# EasyEDA Pro project 整体参考PCB.epro

# Schematic Schematic1
Assembly Variant: Basic; Board Name: Board1; Create Date: 2026-06-18; Page Name: P1; Project Name: TI_MSPM0_2.0; Schematic Name: Schematic1; Update Date: 2026-06-18; Company: 嘉立创EDA; Page Size: A4; Version: V1.0
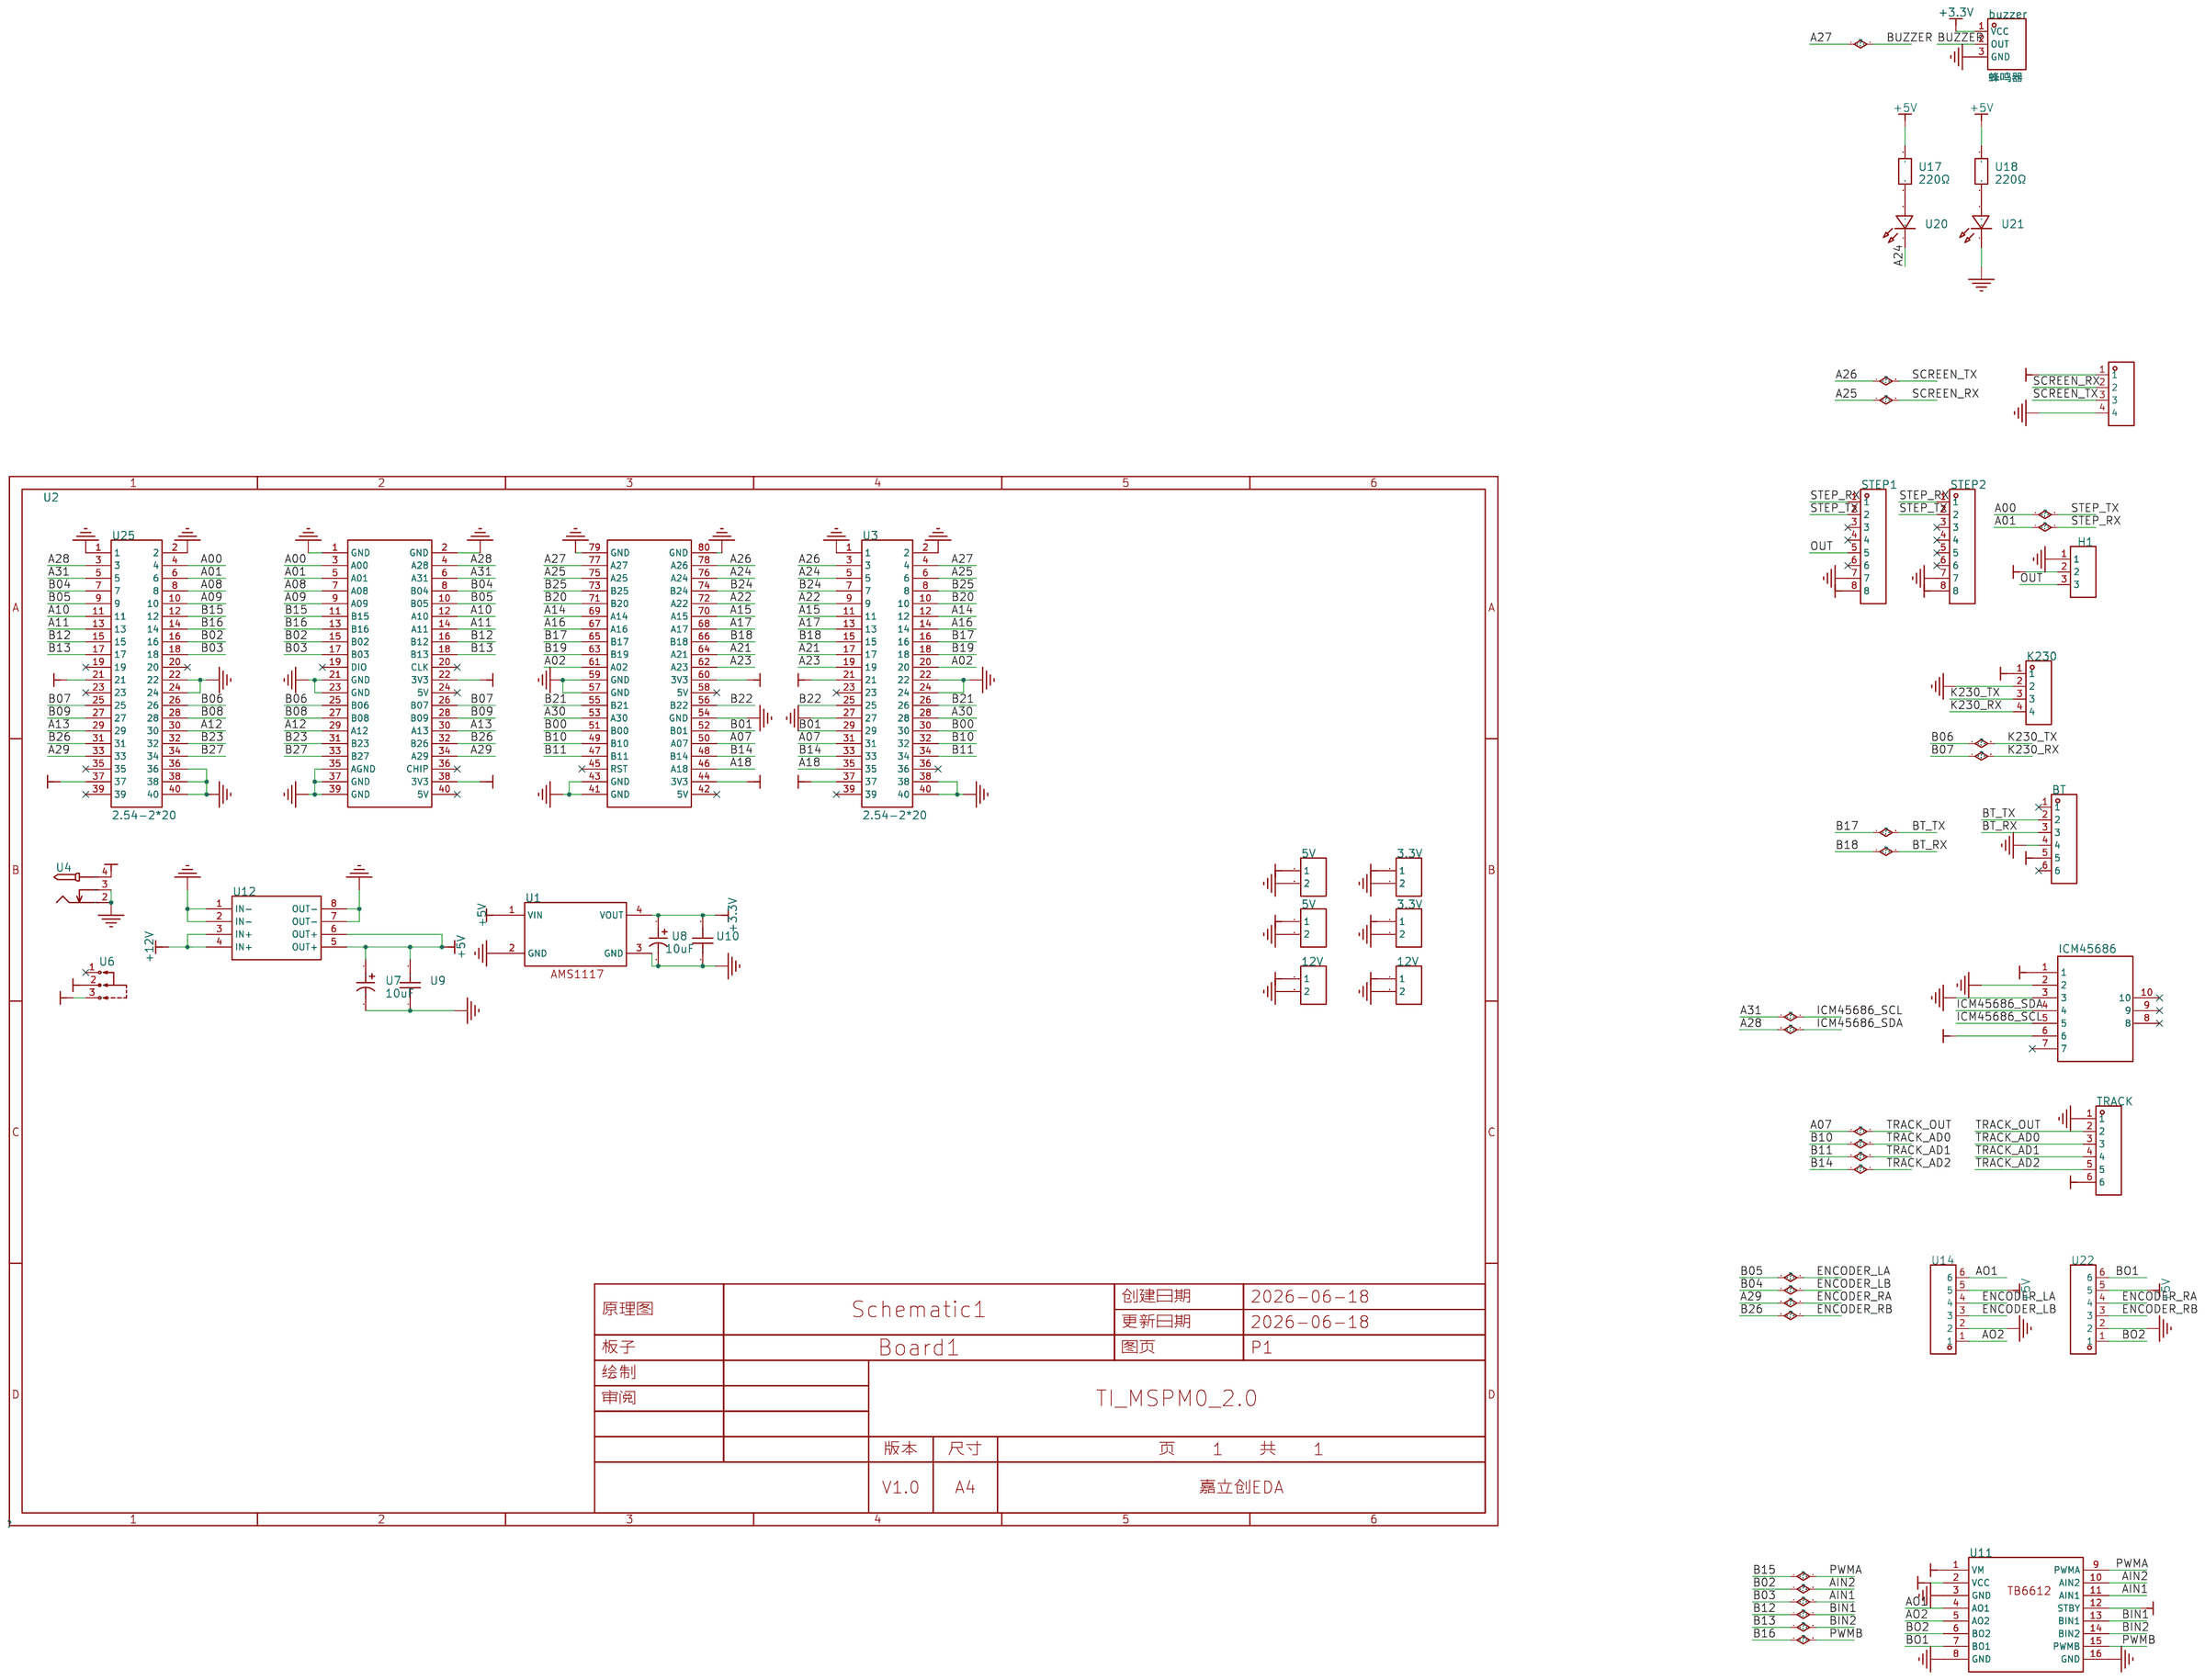
[diagram p0: schematic sheet]

## Parts
3.3V  -  [HDR-TH_2P-P2.54-V-F]
3.3V#2  -  [HDR-TH_2P-P2.54-V-F]
5V  -  [HDR-TH_2P-P2.54-V-F]
5V#2  -  [HDR-TH_2P-P2.54-V-F]
12V  -  [HDR-TH_2P-P2.54-V-F]
12V#2  -  [HDR-TH_2P-P2.54-V-F]
BT  -  [HDR-TH_6P-P2.54-V-F]
buzzer  蜂鸣器  [蜂鸣器]
H1  -  [HDR-TH_3P-P2.54-V-F]
ICM45686  -  [ICM45686]
K230  -  [HDR-TH_4P-P2.54-V-F]
STEP1  ZX-XH2.54-8PZZ  [CONN-TH_8P-P2.50-XH2.54-8P]
STEP2  ZX-XH2.54-8PZZ  [CONN-TH_8P-P2.50-XH2.54-8P]
TRACK  -  [HDR-TH_6P-P2.54-V-F]
U1  -  [AMS1117模块]
U2  LCKFB-TMX-MSPM0G3507  [COMM-TH_LCKFB-TMX-MSPM0G3507]
U3  2.54-2*20  [HDR-TH_40P-P2.54-V-F-R2-C20-S2.54]
U4  DC005-2.5  [DC-IN-TH_DC005-2.5MM]
U6  SS12D10G5  [SW-TH_SHOU-HAN_SS12D10G4]
U7  10uF  [CAP-TH_BD5.0-P2.00-D0.5-FD-1]
U8  10uF  [CAP-TH_BD5.0-P2.00-D0.5-FD-1]
U9  -  [0.1uf陶瓷电容直插]
U10  -  [0.1uf陶瓷电容直插]
U11  -  [TB6612]
U12  -  [MP1584EN降压模块]
U14  ZX-XH2.54-6PWZ  [CONN-TH_6P-P2.50_ZX-XH2.54-6PWZ]
U16  ZX-XH2.54-4PZZ  [CONN-TH_4P-P2.50_4PIN]
U17  220Ω  [RES-TH_BD2.7-L6.2-P10.20-D0.4]
U18  220Ω  [RES-TH_BD2.7-L6.2-P10.20-D0.4]
U20  LTL-307E  [LED-TH_BD3.0-P2.54-FD]
U21  LTL-307E  [LED-TH_BD3.0-P2.54-FD]
U22  ZX-XH2.54-6PWZ  [CONN-TH_6P-P2.50_ZX-XH2.54-6PWZ]
U25  2.54-2*20  [HDR-TH_40P-P2.54-V-F-R2-C20-S2.54]

## Library data of the parts
3.3V 3.3V#2 5V 5V#2 12V 12V#2 = HDR-F_2.54_1x2P: Supplier Part: C49661; Supplier Footprint: 插件
BT TRACK = HDR-F_2.54_1x6P: Supplier Part: C40877; Supplier Footprint: 插件
buzzer = 蜂鸣器: Supplier Part: C9900010938; Datasheet: https://atta.szlcsc.comnull; Supplier: LCSC
H1 = HDR-F_2.54_1x3P: Supplier Part: C541850; Supplier Footprint: 插件
ICM45686 = ICM45686
K230 = HDR-F_2.54_1x4P: Supplier Part: C2718488; Supplier Footprint: 插件
STEP1 STEP2 = ZX-XH2.54-8PZZ: 插针结构:1x8P;间距:2.5mm;安装方式:直插;参考系列:XH;总PIN数:8P;排数:1;每排PIN数:8;行距:-;额定电流:3A;触头材质:黄铜;触头镀层:锡;工作温度:-25℃~+85℃;; LCSC Part Name: 1x8P 间距:2.5mm 直插 系列:XH; Supplier Part: C7429638; Manufacturer: Megastar(兆星); Supplier Footprint: 插件,P=2.5mm; JLCPCB Part Class: Extended Part; Datasheet: https://item.szlcsc.com/datasheet/ZX-XH2.54-8PZZ/8427555.html; Supplier: LCSC; Pins Structure: 1x8P; Pitch: 2.5mm; Mounting Type: 直插; Reference Series: XH; Number of Pins: 8P; Number of Rows: 1; Number of PINs Per Row: 8; Current Rating: 3A; Contact Material: 黄铜; Contact Plating: 锡; Operating Temperature: -25℃~+85℃; Voltage Rating: 250V; Plastic Material: PA66; Flame Retardant Rating: UL94V-0; Color: 白色; Z-Height of the Board: 7mm; X-Length of Bottom Edge on Board (Spacing Line): 22.5mm; Y-Width of Bottom Edge on Board: 5.9mm
U1 = AMS1117模块: _: 3
U2 = LCKFB-TMX-MSPM0G3507: 该开发板板载德州仪器的微控制器核心,完美适配电赛指定TI芯片题目的要求。支持Keil、CCS和IAU等环境开发,搭配图形化代码生成工具,无需在意底层驱动,助力快速开发。硬件上带有多电源保护,防反接/防过流/受电压,和三路参考电压选择,降低电衰试错成本。80P引脚的引出方便扩展,提供完善的入门手册和模块移植案例。; LCSC Part Name: 5件套 立创·天猛星MSPM0G3507开发板; Supplier Part: C42378531; Manufacturer: 立创开发板; JLCPCB Part Class: Extended Part; Datasheet: https://item.szlcsc.com/datasheet/LCKFB-TMX-MSPM0G3507/44281600.html; Supplier: LCSC
U3 U25 = 2.54-2*20: 插孔结构:2x20P;间距:2.54mm;行距:2.54mm;圆孔/方孔:方孔;安装类型:直插;排数:双排;总孔位数:40P;额定电流:2.5A;额定电压:-;插孔方向:顶部;塑高:8.5mm;工作温度范围:-40℃~+105℃;; LCSC Part Name: 间距:2.54mm 2x20P 直插; Supplier Part: C2977589; Manufacturer: ZHOURI(洲日); Supplier Footprint: 插件,P=2.54mm; JLCPCB Part Class: 扩展库; Datasheet: https://atta.szlcsc.com/upload/public/pdf/source/20220328/834E302BE3C038BBC5C70F5E02589B1E.pdf; Supplier: LCSC; Holes Structure: 2x20P; Pitch: 2.54mm; Row Spacing: 2.54mm; Circular Hole / Square Hole: 方孔; Mounting Type: 直插; Number of Rows: 双排; Number of Holes: 40P; Current Rating (Max): 2.5A; Holes Direction: 顶部; Insulation Height: 8.5mm; Operating Temperature Range: -40℃~+105℃
U4 = DC005-2.5: 连接器类型:DC电源插座;安装方式:弯插;触点内径:2.5mm;触点外径:6.3mm;额定电流:500mA;额定电压:30V;工作温度范围:-25℃~+70℃;; LCSC Part Name: DC电源插座 内径:2.5mm 外径:6.3mm; Supplier Part: C7507454; Manufacturer: SHOU HAN(首韩); Supplier Footprint: 插件; JLCPCB Part Class: 扩展库; Datasheet: https://atta.szlcsc.com/upload/public/pdf/source/20231013/7634FFE9E6B635EE77C0C008CDC877DB.pdf; Supplier: LCSC; Connector Type: DC电源插座; Mounting Style: 弯插; Inside Contact Diameter: 2.5mm; Outside Contact Diameter: 6.3mm; Current Rating (Max): 500mA; Voltage Rating (Max): 30V; Operating Temperature Range: -25℃~+70℃
U6 = SS12D10G5: 电路结构:单刀双掷;安装方式:直插;额定电流(DC):2A;额定电压(DC):125V;机械寿命:3千次;; LCSC Part Name: 两档立式插件 3脚拨动开关 柄长5.0mm; Supplier Part: C7431054; Manufacturer: SHOU HAN(首韩); Supplier Footprint: 插件; JLCPCB Part Class: 扩展库; Datasheet: https://atta.szlcsc.com/upload/public/pdf/source/20231130/7A3DB6A149BF0A1DCFFE64FFC07FE434.pdf; Supplier: LCSC; Circuit: 单刀双掷; Switch Length: 12.7mm; Switch Width: 6.7mm; Mounting Style: 直插; Current Rating (DC): 2A; Voltage Rating (DC): 125V; Mechanical Life: 3千次; Operating Temperature: -25℃~+70℃
U7 U8 = CV4R7MG511BP: 容值:4.7uF;精度:±20%;额定电压:50V;纹波电流:58mA@100kHz;等效串联电阻(ESR):2.5Ω@100kHz;; LCSC Part Name: 4.7uF ±20% 50V; Supplier Part: C2844413; Manufacturer: TWBOR(伯鸿); Supplier Footprint: 插件,D5xL11mm; JLCPCB Part Class: 扩展库; Datasheet: https://atta.szlcsc.com/upload/public/pdf/source/20210727/C2844413_0C02A797581ED1BB0754F03B8FF69A80.pdf; Supplier: LCSC; Tolerance: ±20%; Voltage Rating: 50V; Ripple Current: 58mA@100kHz; Equivalent Series Resistance(ESR): 2.5Ω@100kHz; Pin Spacing: 2mm; Diameter: 5mm; Height - Seated (Max): 11mm; Lifetime: 5000hrs@105℃; Operating Temperature: -40℃~+105℃
U9 U10 = 0.1uf陶瓷电容直插
U11 = TB6612
U12 = MP1584EN降压模块: _: 3
U14 U22 = ZX-XH2.54-6PWZ: 插针结构:1x6P;间距:2.5mm;安装方式:弯插;参考系列:XH;总PIN数:6P;排数:1;每排PIN数:6;行距:-;额定电流:2A;触头材质:黄铜;触头镀层:锡;工作温度:-25℃~+85℃;; LCSC Part Name: 1x6P 间距:2.5mm 弯插 系列:XH; Supplier Part: C7429645; Manufacturer: Megastar(兆星); Supplier Footprint: 弯插,P=2.5mm; JLCPCB Part Class: 扩展库; Datasheet: https://item.szlcsc.com/datasheet/ZX-XH2.54-6PWZ/8427562.html; Supplier: LCSC; Pins Structure: 1x6P; Pitch: 2.5mm; Mounting Type: 弯插; Reference Series: XH; Number of Pins: 6P; Number of Rows: 1; Number of PINs Per Row: 6; Current Rating: 2A; Contact Material: 黄铜; Contact Plating: 锡; Operating Temperature: -25℃~+85℃; Voltage Rating: 250V; Plastic Material: PA66; Flame Retardant Rating: UL94V-0; Color: 白色; Z-Height of the Board: 5.9mm; X-Length of Bottom Edge on Board (Spacing Line): 17.5mm; Y-Width of Bottom Edge on Board: 7.32mm
U16 = ZX-XH2.54-4PZZ: 插针结构:1x4P;间距:2.5mm;安装方式:直插;参考系列:XH;总PIN数:4P;排数:1;每排PIN数:4;行距:-;额定电流:3A;触头材质:黄铜;触头镀层:锡;工作温度:-25℃~+85℃;; LCSC Part Name: 1x4P 间距:2.5mm 直插 系列:XH; Supplier Part: C7429634; Manufacturer: Megastar(兆星); Supplier Footprint: 插件,P=2.5mm; JLCPCB Part Class: 扩展库; Datasheet: https://item.szlcsc.com/datasheet/ZX-XH2.54-4PZZ/8427551.html; Supplier: LCSC; Pins Structure: 1x4P; Pitch: 2.5mm; Mounting Type: 直插; Reference Series: XH; Number of Pins: 4P; Number of Rows: 1; Number of PINs Per Row: 4; Current Rating: 3A; Contact Material: 黄铜; Contact Plating: 锡; Operating Temperature: -25℃~+85℃; Voltage Rating: 250V; Plastic Material: PA66; Flame Retardant Rating: UL94V-0; Color: 白色; Z-Height of the Board: 7mm; X-Length of Bottom Edge on Board (Spacing Line): 12.5mm; Y-Width of Bottom Edge on Board: 5.9mm
U17 U18 = MF1/4W-1K±1%-ST52: 电阻类型:金属膜电阻;阻值:1kΩ;精度:±1%;功率:250mW;温度系数:±100ppm/℃;; LCSC Part Name: 金属膜电阻 1kΩ ±1% 250mW; Supplier Part: C2903245; Manufacturer: VO(翔胜); Supplier Footprint: 插件,D2.7xL6.2mm; JLCPCB Part Class: 扩展库; Datasheet: https://atta.szlcsc.com/upload/public/pdf/source/20200609/C601728_5AA4C0C8E12E11069DA2C3356F29D1F2.pdf; Supplier: LCSC; Type: 金属膜电阻; Tolerance: ±1%; Overload Voltage (Max): 250V; Power(Watts): 250mW; Temperature Coefficient: ±100ppm/℃; Operating Temperature Range: -55℃~+155℃
U20 U21 = LTL-307E: 发光颜色:红色;正向电压(VF):2V;正向电流:20mA;主波长:623nm;透镜颜色:红色透镜;发光强度:19mcd;发光角度:50°;; LCSC Part Name: 直插F5红光LED; Supplier Part: C575489; Manufacturer: LITEON(光宝); Supplier Footprint: 插件; JLCPCB Part Class: 扩展库; Supplier: LCSC; Emitted Color: 红色; Forward Voltage (VF): 2V; Forward Current: 20mA; Dominant Wavelength: 623nm; Peak Wavelength: 635nm; Lens Color: 红色透镜; Luminous Intensity: 19mcd; Viewing Angle: 50°

## Nets
+3.3V: 3.3V.1 3.3V#2.1 buzzer.1(VCC) ICM45686.1 ICM45686.6 U1.4(VOUT) U2.22(3V3) U2.38(3V3) U2.44(3V3) U2.60(3V3) U3.21 U3.37 U8.1 U10.2 U25.21 U25.37
+5V: 5V.1 5V#2.1 BT.5 H1.2 K230.1 TRACK.6 U1.1(VIN) U7.1 U9.2 U11.2(VCC) U11.12(STBY) U12.5(OUT+) U12.6(OUT+) U14.5 U16.1 U17.2 U18.2 U22.5
+12V: 12V.1 12V#2.1 STEP1.8 STEP2.8 U6.3 U11.1(VM) U12.3(IN+) U12.4(IN+)
GND: 3.3V.2 3.3V#2.2 5V.2 5V#2.2 12V.2 12V#2.2 BT.4 buzzer.3(GND) H1.1 ICM45686.2 ICM45686.3 K230.2 STEP1.7 STEP2.7 TRACK.1 U1.2(GND) U1.3(GND) U2.1(GND) U2.2(GND) U2.21(GND) U2.23(GND) U2.35(AGND) U2.37(GND) U2.39(GND) U2.41(GND) U2.43(GND) U2.54(GND) U2.57(GND) U2.59(GND) U2.79(GND) U2.80(GND) U3.1 U3.2 U3.22 U3.24 U3.27 U3.38 U3.40 U4.2 U4.3 U7.2 U8.2 U9.1 U10.1 U11.3(GND) U11.8(GND) U11.16(GND) U12.1(IN-) U12.2(IN-) U12.7(OUT-) U12.8(OUT-) U14.2 U16.4 U21.1(C) U22.2 U25.1 U25.2 U25.22 U25.24 U25.36 U25.38 U25.40
VCC: U4.4 U6.2
A00: STEP1.2 STEP2.2 U2.3(A00) U25.4
A01: STEP1.1 STEP2.1 U2.5(A01) U25.6
A02: U2.61(A02) U3.20
A07: TRACK.2 U2.50(A07) U3.31
A08: U2.7(A08) U25.8
A09: U2.9(A09) U25.10
A10: U2.12(A10) U25.11
A11: U2.14(A11) U25.13
A12: U2.29(A12) U25.30
A13: U2.30(A13) U25.29
A14: U2.69(A14) U3.12
A15: U2.70(A15) U3.11
A16: U2.67(A16) U3.14
A17: U2.68(A17) U3.13
A18: U2.46(A18) U3.35
A21: U2.64(A21) U3.17
A22: U2.72(A22) U3.9
A23: U2.62(A23) U3.19
A24: U2.76(A24) U3.5 U20.1(C)
A25: U2.75(A25) U3.6 U16.2
A26: U2.78(A26) U3.3 U16.3
A27: buzzer.2(OUT) U2.77(A27) U3.4
A28: ICM45686.4 U2.4(A28) U25.3
A29: U2.34(A29) U22.4 U25.33
A30: U2.53(A30) U3.28
A31: ICM45686.5 U2.6(A31) U25.5
AIN1: U2.17(B03) U11.11(AIN1) U25.18
AIN2: U2.15(B02) U11.10(AIN2) U25.16
AO1: U11.4(AO1) U14.6
AO2: U11.5(AO2) U14.1
B00: U2.51(B00) U3.30
B01: U2.52(B01) U3.29
B04: U2.8(B04) U14.3 U25.7
B05: U2.10(B05) U14.4 U25.9
B06: K230.3 U2.25(B06) U25.26
B07: K230.4 U2.26(B07) U25.25
B08: U2.27(B08) U25.28
B09: U2.28(B09) U25.27
B10: TRACK.3 U2.49(B10) U3.32
B11: TRACK.4 U2.47(B11) U3.34
B12: U2.16(B12) U11.13(BIN1) U25.15
B13: U2.18(B13) U11.14(BIN2) U25.17
B14: TRACK.5 U2.48(B14) U3.33
B15: U2.11(B15) U11.9(PWMA) U25.12
B16: U2.13(B16) U11.15(PWMB) U25.14
B17: BT.2 U2.65(B17) U3.16
B18: BT.3 U2.66(B18) U3.15
B19: U2.63(B19) U3.18
B20: U2.71(B20) U3.10
B21: U2.55(B21) U3.26
B22: U2.56(B22) U3.25
B23: U2.31(B23) U25.32
B24: U2.74(B24) U3.7
B25: U2.73(B25) U3.8
B26: U2.32(B26) U22.3 U25.31
B27: U2.33(B27) U25.34
BO1: U11.7(BO1) U22.6
BO2: U11.6(BO2) U22.1
OUT: H1.3 STEP1.5
$1N61: U18.1 U21.2(A)
$1N76: U17.1 U20.2(A)

Not connected (* = marked no-connect by the designer): BT 1* 6*; ICM45686 7* 8* 9* 10*; STEP1 3* 4* 6*; STEP2 3* 4* 5* 6*; U2 19(DIO)* 20(CLK)* 24(5V)* 36(CHIP)* 40(5V)* 42(5V)* 45(RST)* 58(5V)*; U3 23* 36* 39*; U6 1*; U25 19* 20* 23* 35* 39*

# Board PCB1
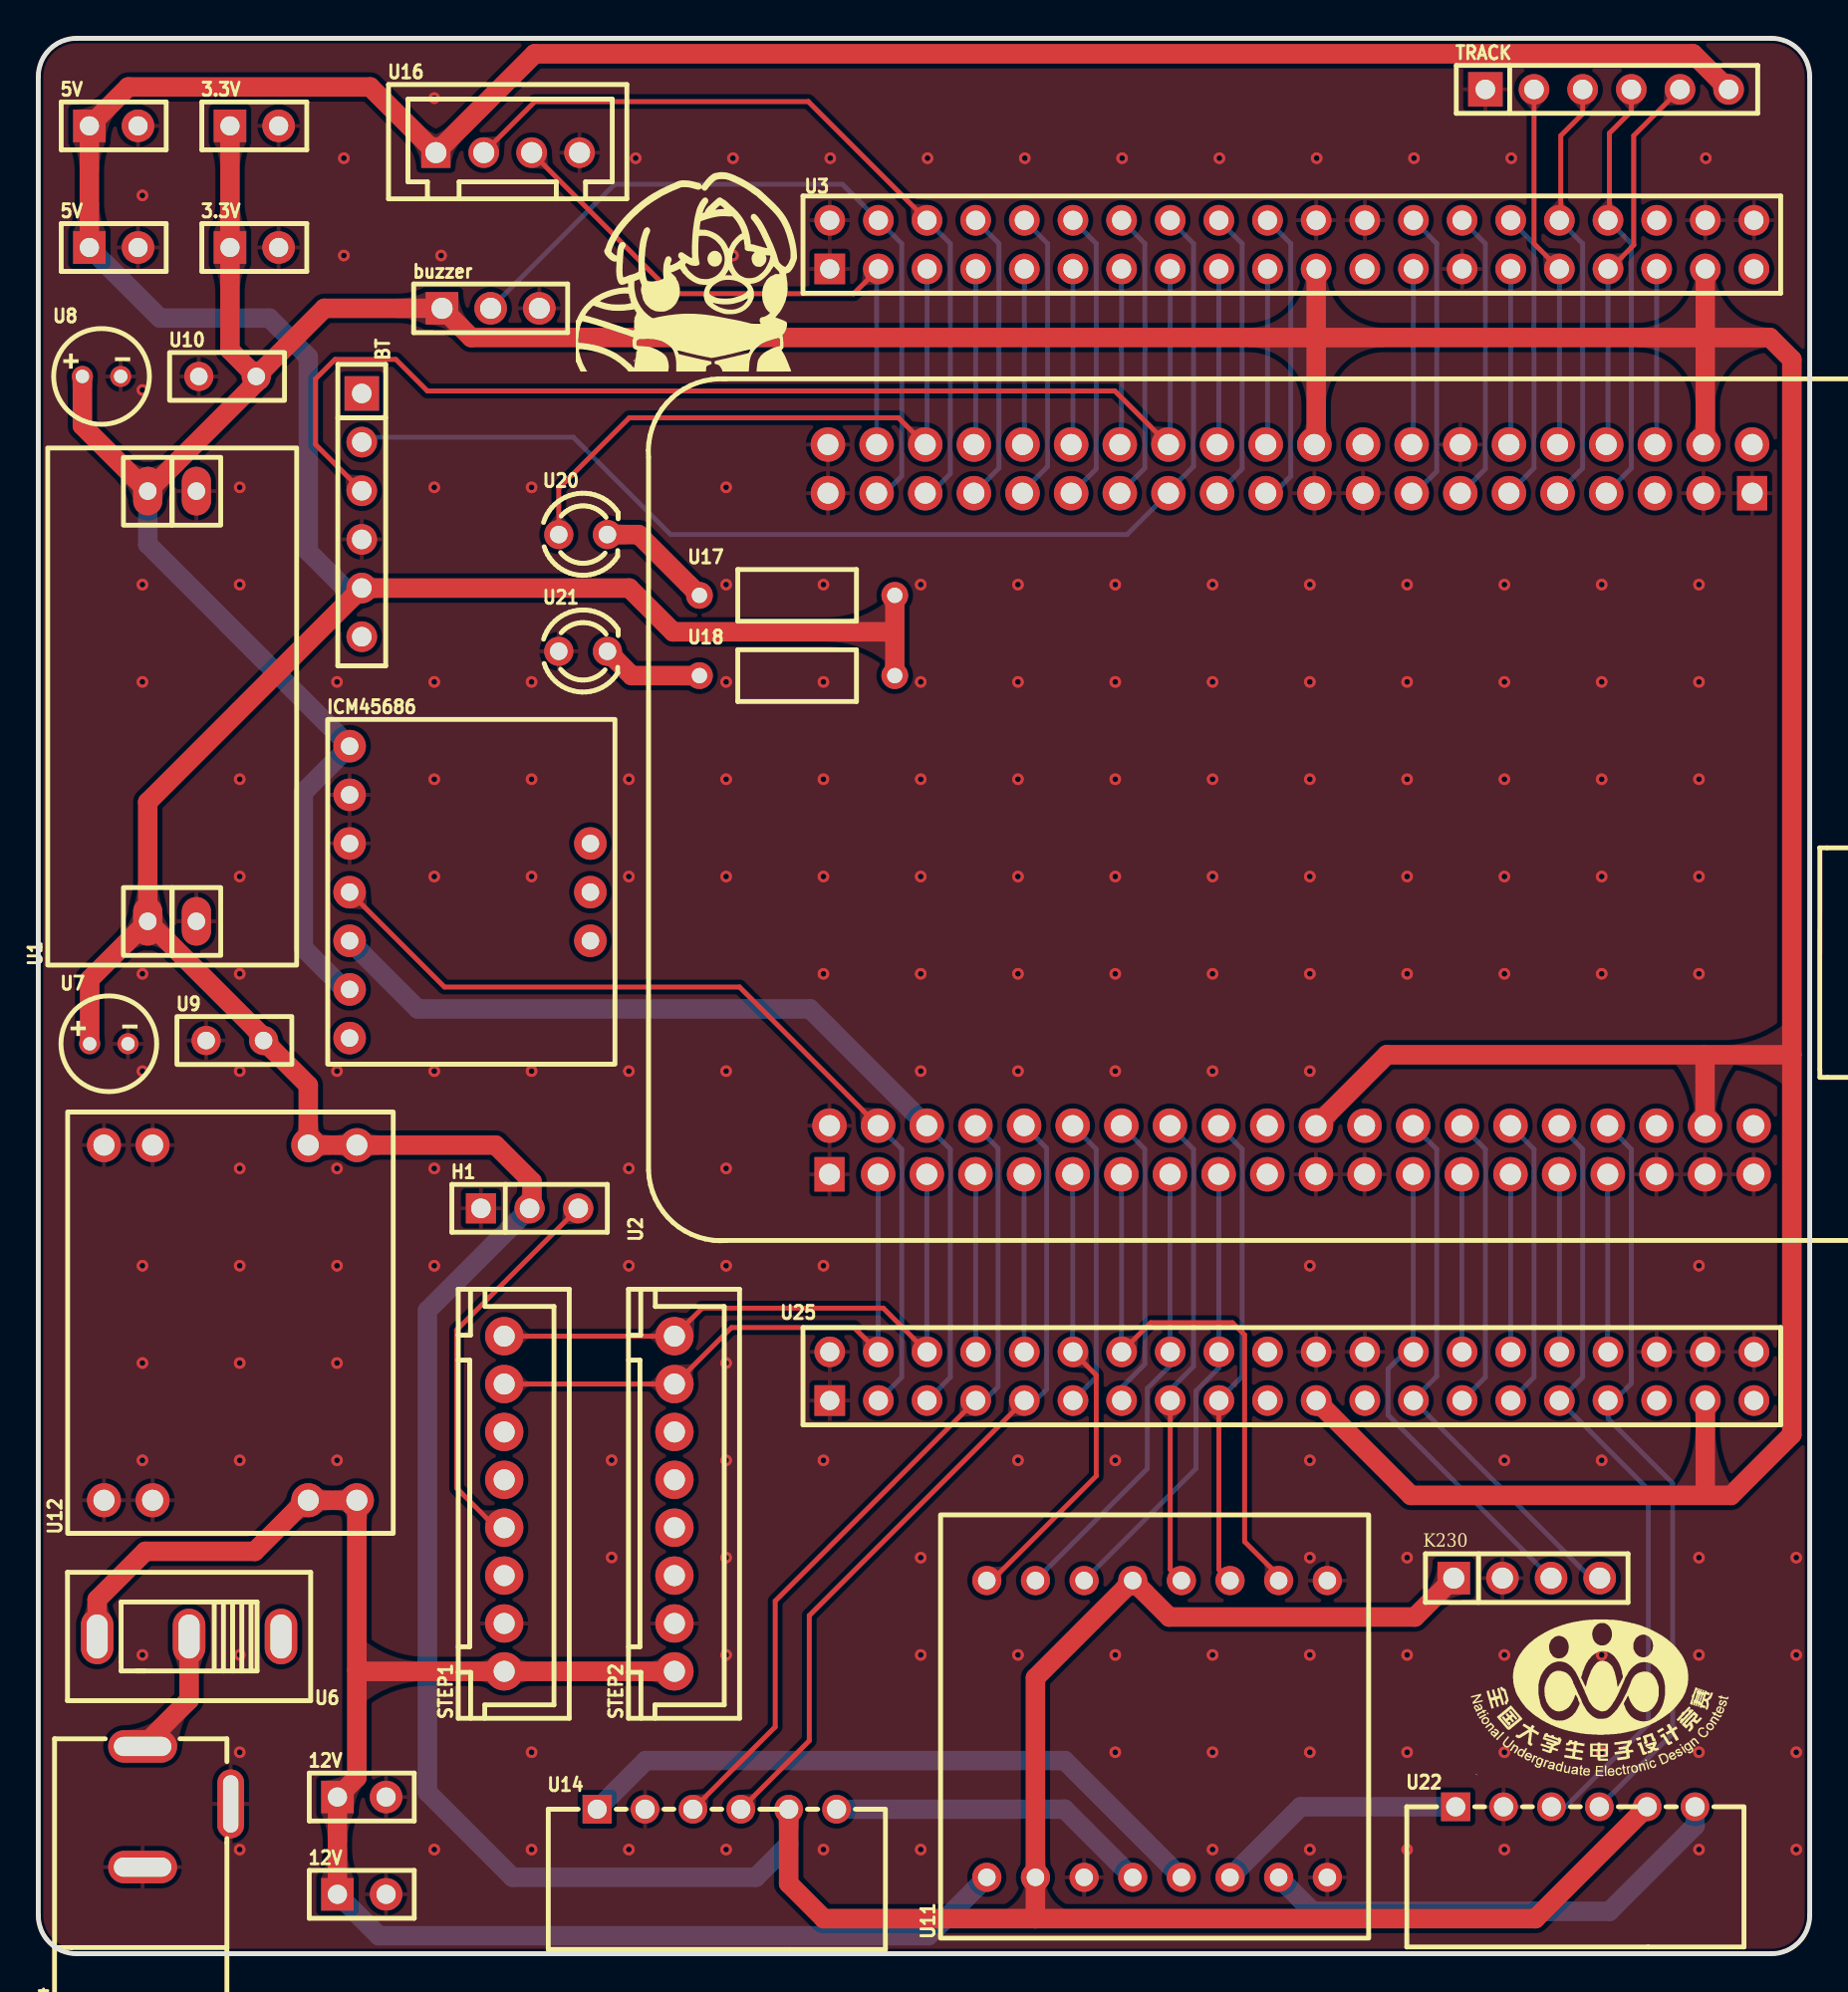
[diagram p1: board, top side]
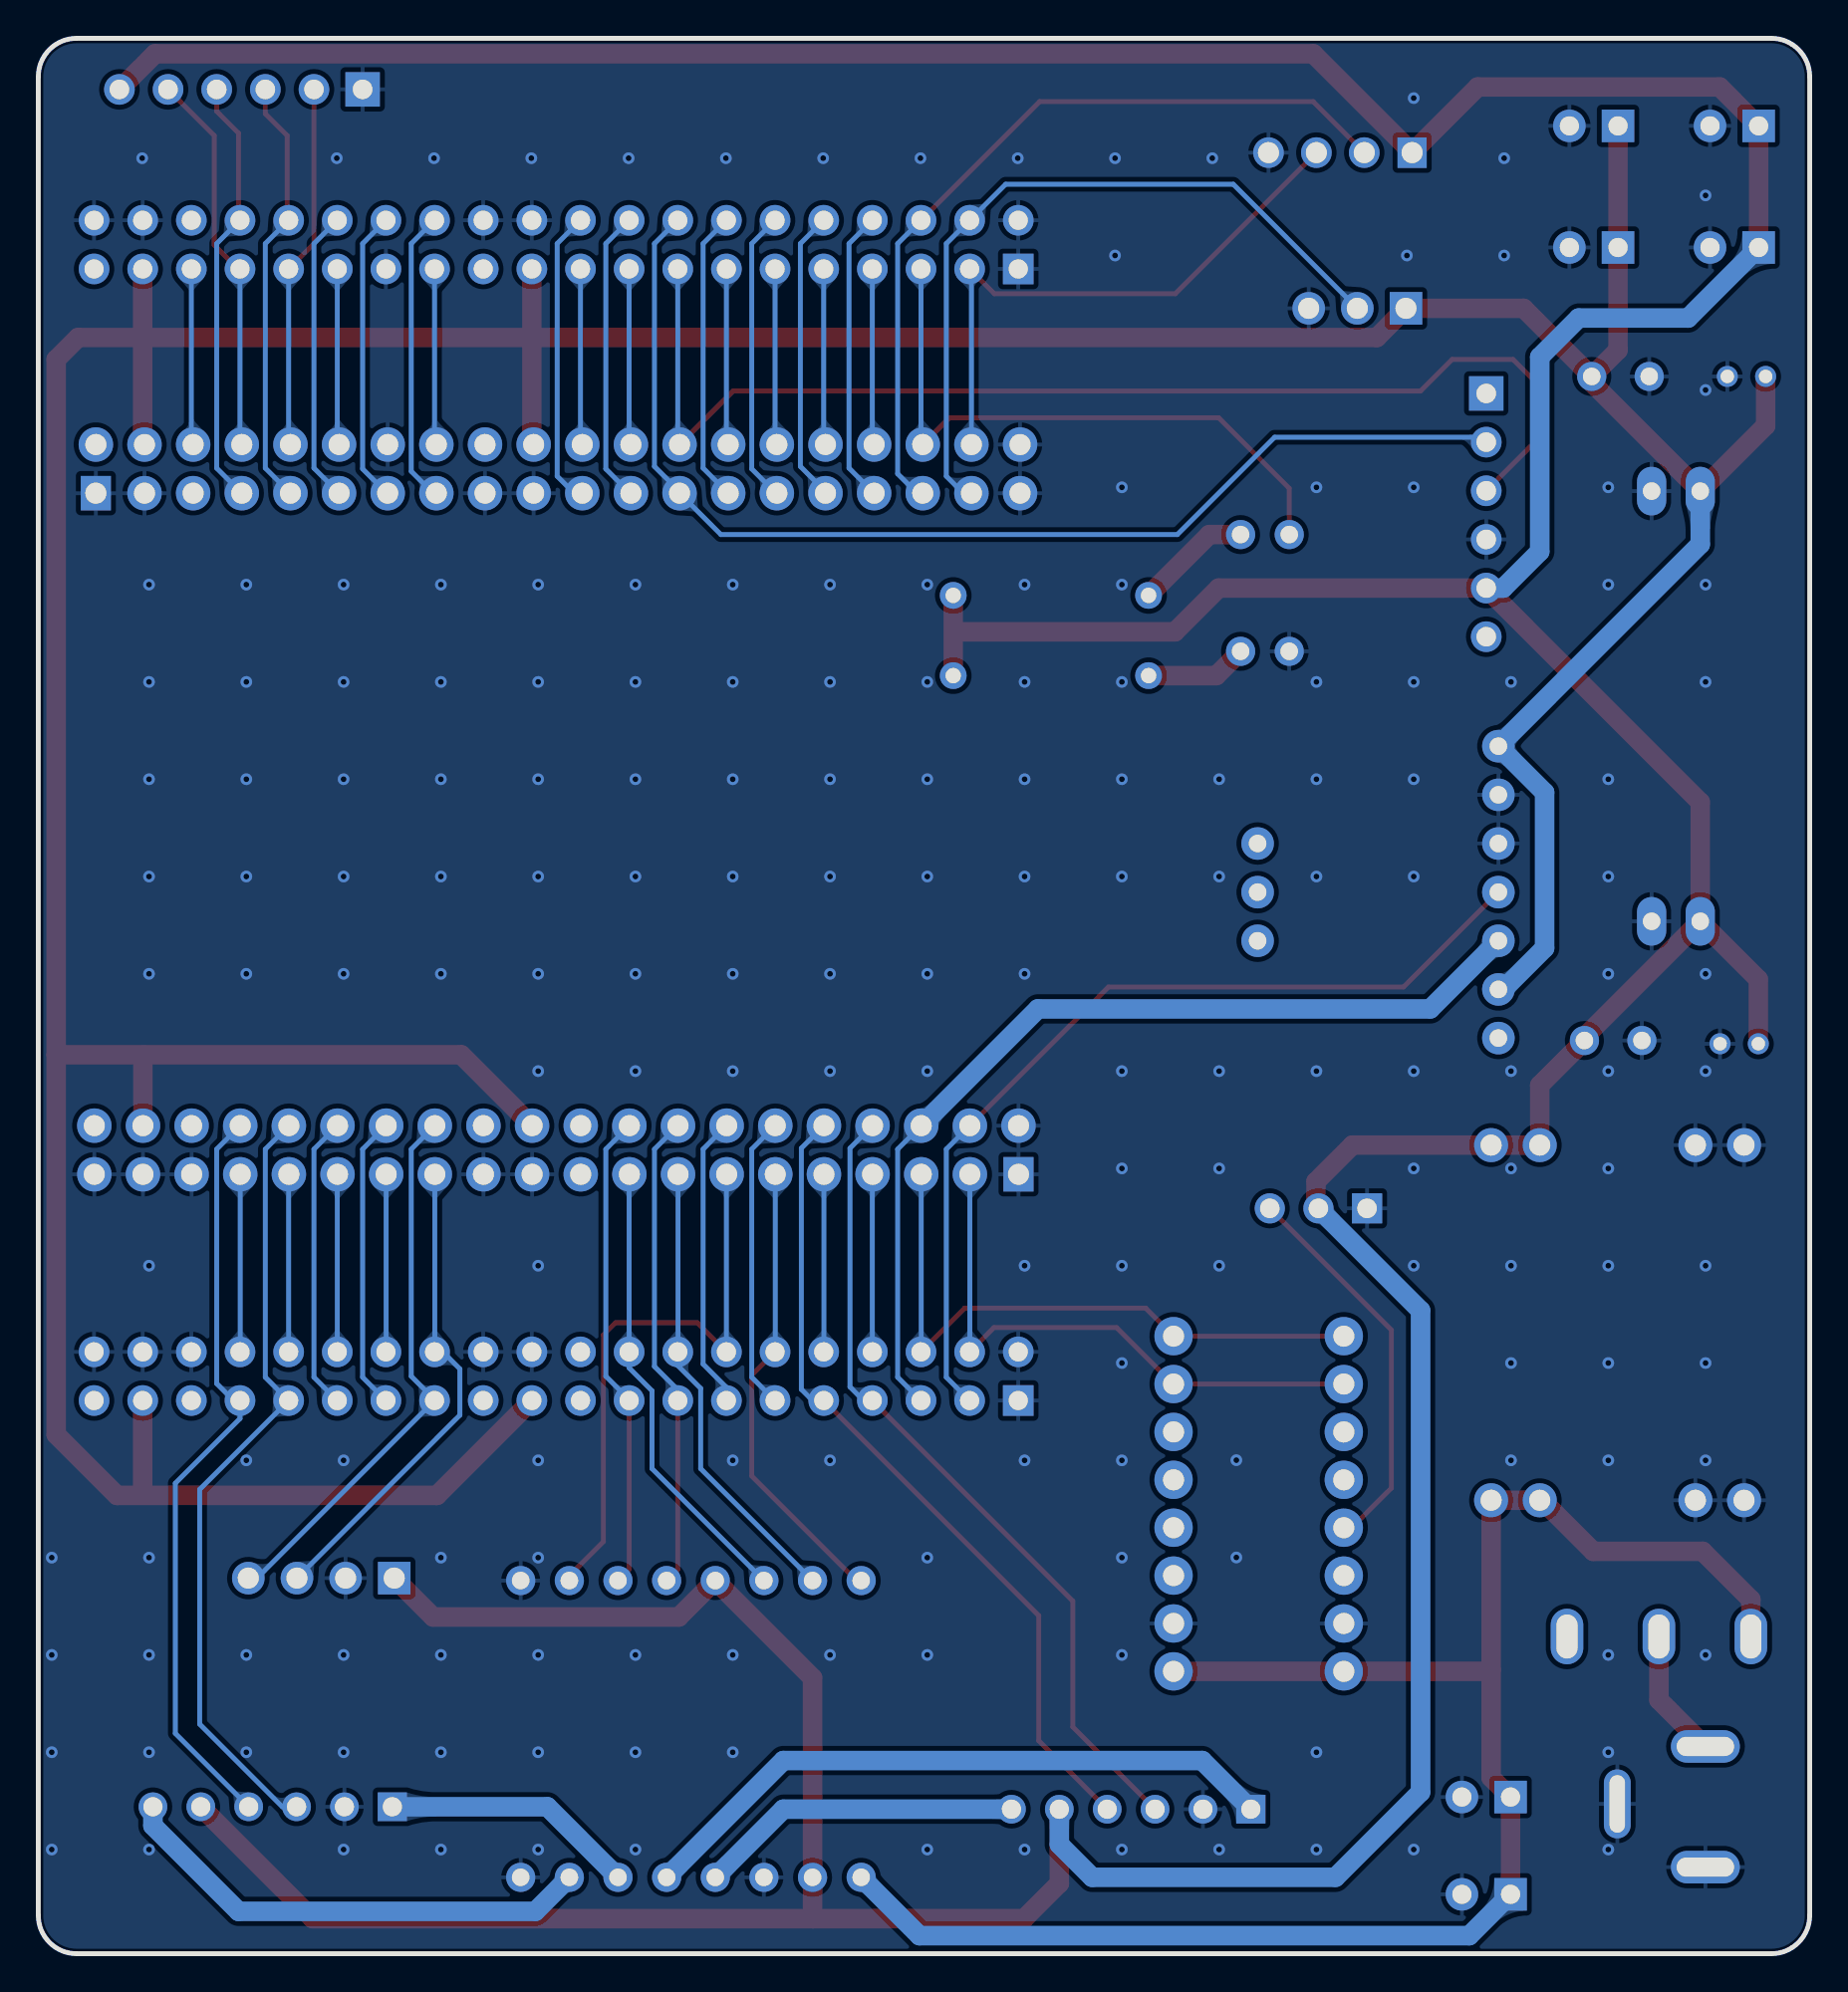
[diagram p2: board, bottom side, seen from below]

Outline 92.5 x 100 mm; copper layers: Top Layer, Bottom Layer. Coordinates in mm from the lower left corner of the outline.
Outline path: 0,98 0,2 arc(0.59,0.59) 2,0 90.5,0 arc(91.91,0.59) 92.5,2 92.5,98 arc(91.91,99.41) 90.5,100 2,100 arc(0.59,99.41) 0,98
Stack: Top Layer 0.035mm / Dielectric1 1.51mm FR4 er 4.5 / Bottom Layer 0.035mm

## Design rules (mm)
spacing copperThickness1oz (default): track to track 0.102, other pairs 0.152 to 0.3
spacing copperThickness2oz: track to track 0.203, other pairs 0.152 to 0.3
track width copperThickness1oz (default): min 0.127, default 0.254, max 2.54
track width copperThickness2oz: min 0.203, default 0.254, max 2.54
differential pair differentialPair (default): width min 0.127, default 0.254, max 2.54; gap min 0.152, default 0.152
net GND uses copperRegion

## Placement (name value [footprint] x y rotation side)
3.3V  -  [HDR-TH_2P-P2.54-V-F]  11.28 95.43 0 top
3.3V#2  -  [HDR-TH_2P-P2.54-V-F]  11.28 89.08 0 top
5V  -  [HDR-TH_2P-P2.54-V-F]  3.94 89.08 0 top
5V#2  -  [HDR-TH_2P-P2.54-V-F]  3.94 95.43 0 top
12V  -  [HDR-TH_2P-P2.54-V-F]  16.89 8.18 0 top
12V#2  -  [HDR-TH_2P-P2.54-V-F]  16.89 3.1 0 top
BT  -  [HDR-TH_6P-P2.54-V-F]  16.89 75.11 270 top
buzzer  -  [蜂鸣器]  23.62 85.9 0 top
H1  -  [HDR-TH_3P-P2.54-V-F]  25.65 38.91 0 top
ICM45686  -  [ICM45686]  54.61 40.06 0 top
K230  -  [HDR-TH_4P-P2.54-V-F]  77.72 19.61 0 top
STEP1  ZX-XH2.54-8PZZ  [CONN-TH_8P-P2.50-XH2.54-8P]  24.33 23.49 90 top
STEP2  ZX-XH2.54-8PZZ  [CONN-TH_8P-P2.50-XH2.54-8P]  33.22 23.49 90 top
TRACK  -  [HDR-TH_6P-P2.54-V-F]  81.91 97.33 0 top
U1  -  [AMS1117模块]  6.98 64.57 90 top
U2  LCKFB-TMX-MSPM0G3507  [COMM-TH_LCKFB-TMX-MSPM0G3507]  65.41 59.74 90 top
U3  2.54-2*20  [HDR-TH_40P-P2.54-V-F-R2-C20-S2.54]  65.59 89.08 0 top
U4  DC005-2.5  [DC-IN-TH_DC005-2.5MM]  7.75 7.67 90 top
U6  SS12D10G5  [SW-TH_SHOU-HAN_SS12D10G4]  7.87 16.56 180 top
U7  10uF  [CAP-TH_BD5.0-P2.00-D0.5-FD-1]  3.68 47.51 0 top
U8  10uF  [CAP-TH_BD5.0-P2.00-D0.5-FD-1]  3.3 82.35 0 top
U9  -  [0.1uf陶瓷电容直插]  9.78 47.8 0 top
U10  -  [0.1uf陶瓷电容直插]  9.4 82.47 0 top
U11  -  [TB6612]  46.99 0.69 90 top
U12  -  [MP1584EN降压模块]  10.03 32.94 90 top
U14  ZX-XH2.54-6PWZ  [CONN-TH_6P-P2.50_ZX-XH2.54-6PWZ]  35.43 7.54 0 top
U16  ZX-XH2.54-4PZZ  [CONN-TH_4P-P2.50_4PIN]  24.51 94.03 0 top
U17  220Ω  [RES-TH_BD2.7-L6.2-P10.20-D0.4]  39.62 70.92 0 top
U18  220Ω  [RES-TH_BD2.7-L6.2-P10.20-D0.4]  39.62 66.73 0 top
U20  LTL-307E  [LED-TH_BD3.0-P2.54-FD]  28.45 74.09 0 top
U21  LTL-307E  [LED-TH_BD3.0-P2.54-FD]  28.45 68 0 top
U22  ZX-XH2.54-6PWZ  [CONN-TH_6P-P2.50_ZX-XH2.54-6PWZ]  80.26 7.67 0 top
U25  2.54-2*20  [HDR-TH_40P-P2.54-V-F-R2-C20-S2.54#2]  64.31 30.28 0 top

## Footprints (pads in the part's own frame, mm; a bottom-side part is the same pattern mirrored in y, then rotated)
0.1uf陶瓷电容直插
  round 1.524 hole 0.914: 1(-1.016,-0.127) 2(1.984,-0.127)
AMS1117模块
  oval 2.54x1.524 hole 0.914: 1(-10.668,1.27) 2(-10.668,-1.27) 3(11.792,-1.27) 4(11.792,1.27)
CAP-TH_BD5.0-P2.00-D0.5-FD-1
  round 1.1 hole 0.7: 1(-1,0) 2(1,0)
COMM-TH_LCKFB-TMX-MSPM0G3507
  rect 1.8x1.575 hole 1.1: 1(-19.05,24.09) 41(16.51,-24.09)
  round 1.8 hole 1.1: 2(-16.51,24.09) 3(-19.05,21.549) 4(-16.51,21.549) 5(-19.05,19.009) 6(-16.51,19.009) 7(-19.05,16.47) 8(-16.51,16.47) 9(-19.05,13.93) 10(-16.51,13.93) 11(-19.05,11.389) 12(-16.51,11.389) 13(-19.05,8.85) 14(-16.51,8.85) 15(-19.05,6.309) 16(-16.51,6.309) 17(-19.05,3.769) 18(-16.51,3.769) 19(-19.05,1.23) 20(-16.51,1.23) 21(-19.05,-1.31) 22(-16.51,-1.31) 23(-19.05,-3.85) 24(-16.51,-3.85) 25(-19.05,-6.391) 26(-16.51,-6.391) 27(-19.05,-8.931) 28(-16.51,-8.931) 29(-19.05,-11.47) 30(-16.51,-11.47) 31(-19.05,-14.011) 32(-16.51,-14.011) 33(-19.05,-16.55) 34(-16.51,-16.55) 35(-19.05,-19.09) 36(-16.51,-19.09) 37(-19.05,-21.631) 38(-16.51,-21.631) 39(-19.05,-24.171) 40(-16.51,-24.171) 42(19.05,-24.09) 43(16.51,-21.549) 44(19.05,-21.549) 45(16.51,-19.009) 46(19.05,-19.009) 47(16.51,-16.47) 48(19.05,-16.47) 49(16.51,-13.93) 50(19.05,-13.93) 51(16.51,-11.389) 52(19.05,-11.389) 53(16.51,-8.85) 54(19.05,-8.85) 55(16.51,-6.309) 56(19.05,-6.309) 57(16.51,-3.769) 58(19.05,-3.769) 59(16.51,-1.23) 60(19.05,-1.23) 61(16.51,1.31) 62(19.05,1.31) 63(16.51,3.85) 64(19.05,3.85) 65(16.51,6.391) 66(19.05,6.391) 67(16.51,8.931) 68(19.05,8.931) 69(16.51,11.47) 70(19.05,11.47) 71(16.51,14.011) 72(19.05,14.011) 73(16.51,16.55) 74(19.05,16.55) 75(16.51,19.09) 76(19.05,19.09) 77(16.51,21.631) 78(19.05,21.631) 79(16.51,24.171) 80(19.05,24.171)
CONN-TH_4P-P2.50_4PIN
  rect 1.524x1.6 hole 1.1: 1(-3.75,0)
  round 1.6 hole 1.1: 2(-1.25,0) 3(1.25,0) 4(3.75,0)
CONN-TH_6P-P2.50_ZX-XH2.54-6PWZ
  rect 1.524x1.5 hole 1: 1(-6.25,0)
  round 1.5 hole 1: 2(-3.75,0) 3(-1.25,0) 4(1.25,0) 5(3.75,0) 6(6.25,0)
CONN-TH_8P-P2.50-XH2.54-8P
  round 2 hole 1.1: 1(8.75,0) 2(6.25,0) 3(3.75,0) 4(1.25,0) 5(-1.25,0) 6(-3.75,0) 7(-6.25,0) 8(-8.75,0)
DC-IN-TH_DC005-2.5MM
  oval 3.6x1.4 hole 3x0.8: 2(0.15,-2.3)
  oval 1.7x3.6 hole 1x3: 3(-3.15,2.3) 4(3.15,2.3)
HDR-TH_2P-P2.54-V-F
  rect 1.7x1.7 hole 1: 1(-1.27,0)
  round 1.7 hole 1: 2(1.27,0)
HDR-TH_3P-P2.54-V-F
  rect 1.575x1.575 hole 1.02: 1(-2.54,0)
  round 1.575 hole 1.02: 2(0,0) 3(2.54,0)
HDR-TH_4P-P2.54-V-F
  rect 1.7x1.7 hole 1.1: 1(-3.81,0)
  round 1.7 hole 1.1: 2(-1.27,0) 3(1.27,0) 4(3.81,0)
HDR-TH_6P-P2.54-V-F
  rect 1.8x1.8 hole 1.02: 1(-6.35,0)
  round 1.6 hole 1.02: 2(-3.81,0) 3(-1.27,0) 4(1.27,0) 5(3.81,0) 6(6.35,0)
HDR-TH_40P-P2.54-V-F-R2-C20-S2.54
  rect 1.6x1.6 hole 1: 1(-24.257,-1.119)
  round 1.6 hole 1: 2(-24.257,1.421) 3(-21.717,-1.119) 4(-21.717,1.421) 5(-19.177,-1.119) 6(-19.177,1.421) 7(-16.637,-1.119) 8(-16.637,1.421) 9(-14.097,-1.119) 10(-14.097,1.421) 11(-11.557,-1.119) 12(-11.557,1.421) 13(-9.017,-1.119) 14(-9.017,1.421) 15(-6.477,-1.119) 16(-6.477,1.421) 17(-3.937,-1.119) 18(-3.937,1.421) 19(-1.397,-1.119) 20(-1.397,1.421) 21(1.143,-1.119) 22(1.143,1.421) 23(3.683,-1.119) 24(3.683,1.421) 25(6.223,-1.119) 26(6.223,1.421) 27(8.763,-1.119) 28(8.763,1.421) 29(11.303,-1.119) 30(11.303,1.421) 31(13.843,-1.119) 32(13.843,1.421) 33(16.383,-1.119) 34(16.383,1.421) 35(18.923,-1.119) 36(18.923,1.421) 37(21.463,-1.119) 38(21.463,1.421) 39(24.003,-1.119) 40(24.003,1.421)
HDR-TH_40P-P2.54-V-F-R2-C20-S2.54#2
  rect 1.6x1.6 hole 1: 1(-22.987,-1.397)
  round 1.6 hole 1: 2(-22.987,1.143) 3(-20.447,-1.397) 4(-20.447,1.143) 5(-17.907,-1.397) 6(-17.907,1.143) 7(-15.367,-1.397) 8(-15.367,1.143) 9(-12.827,-1.397) 10(-12.827,1.143) 11(-10.287,-1.397) 12(-10.287,1.143) 13(-7.747,-1.397) 14(-7.747,1.143) 15(-5.207,-1.397) 16(-5.207,1.143) 17(-2.667,-1.397) 18(-2.667,1.143) 19(-0.127,-1.397) 20(-0.127,1.143) 21(2.413,-1.397) 22(2.413,1.143) 23(4.953,-1.397) 24(4.953,1.143) 25(7.493,-1.397) 26(7.493,1.143) 27(10.033,-1.397) 28(10.033,1.143) 29(12.573,-1.397) 30(12.573,1.143) 31(15.113,-1.397) 32(15.113,1.143) 33(17.653,-1.397) 34(17.653,1.143) 35(20.193,-1.397) 36(20.193,1.143) 37(22.733,-1.397) 38(22.733,1.143) 39(25.273,-1.397) 40(25.273,1.143)
ICM45686
  round 1.7 hole 0.914: 1(-38.354,22.987) 2(-38.354,20.447) 3(-38.354,17.907) 4(-38.354,15.367) 5(-38.354,12.827) 6(-38.354,10.287) 7(-38.354,7.747) 8(-25.781,17.907) 9(-25.781,15.367) 10(-25.781,12.827)
LED-TH_BD3.0-P2.54-FD
  round 1.524 hole 0.914: 1(-1.27,0) 2(1.27,0)
MP1584EN降压模块
  round 1.778 hole 1.1: 1(-9.271,6.604) 2(-9.271,4.064) 3(-9.271,-4.064) 4(-9.271,-6.604) 5(9.271,-6.604) 6(9.271,-4.064) 7(9.271,4.064) 8(9.271,6.604)
RES-TH_BD2.7-L6.2-P10.20-D0.4
  round 1.4 hole 0.8: 1(-5.1,0) 2(5.1,0)
SW-TH_SHOU-HAN_SS12D10G4
  oval 1.7x2.9 hole 1.1x2.3: 1(-4.8,0) 2(0,0) 3(4.8,0)
TB6612
  round 1.524 hole 0.914: 1(3.302,-2.54) 2(3.3,-5.08) 3(3.3,-7.62) 4(3.3,-10.16) 5(3.3,-12.7) 6(3.3,-15.24) 7(3.3,-17.78) 8(3.3,-20.32) 9(18.796,-2.54) 10(18.796,-5.08) 11(18.796,-7.62) 12(18.796,-10.16) 13(18.796,-12.7) 14(18.796,-15.24) 15(18.796,-17.78) 16(18.796,-20.32)
蜂鸣器
  rect 1.7x1.7 hole 1.1: 1(-2.54,0)
  round 1.7 hole 1.1: 2(0,0) 3(2.54,0)

## Nets
As in the schematic.

Pads without a net: BT 1 6; ICM45686 7 8 9 10; STEP1 3 4 6; STEP2 3 4 5 6; U2 19 20 24 36 40 42 45 58; U3 23 36 39; U6 1; U25 19 20 23 35 39

## Via types
v1: diameter 0.61, hole 0.305, Top Layer to Bottom Layer, 176 vias

## Routing (per net, layer and track width the routed paths; a pad name or vN(x,y) marks a point on that pad's centre or on a via; arc(x,y) is an arc through that point)
+3.3V: length 282.1
  Top Layer w1.016: 66.73,84.38 66.73,78.88 U2.60 ; 66.73,84.38 87.05,84.38 ; 66.73,84.38 U3.21 ; 66.73,84.38 22.61,84.38 buzzer.1 14.94,85.9 U10.2 ; U25.21 71.68,23.93 88.39,23.93 91.57,27.1 91.57,46.93 ; 87.05,84.38 87.05,78.88 U2.44 ; 87.05,84.38 U3.37 ; 87.05,84.38 90.42,84.38 91.57,83.23 91.57,46.93 ; U10.2 10.01,83.72 3.3V#2.1 3.3V.1 ; U10.2 11.38,82.03 U1.4 2.3,79.77 U8.1 ; U2.38 87.04,46.87 87,46.91 ; U25.37 87.05,24.31 ; 91.57,46.93 70.42,46.93 U2.22
  Bottom Layer w1.016: ICM45686.6 16,50.34 13.84,52.5 13.84,60.63 16.26,63.04 5.72,73.58 U1.4
+5V: length 362.1
  Top Layer w1.016: TRACK.6 86.41,99.19 25.92,99.19 U16.1 17.33,97.46 4.7,97.46 5V#2.1 5V.1 ; U1.1 11.76,47.85 11.76,47.68 14.1,45.34 14.1,42.22 U12.5 23.88,42.22 25.78,40.31 25.78,39.04 H1.2 ; U1.1 2.68,50.87 U7.1 ; U1.1 5.72,60.12 BT.5 30.86,71.3 33.15,69.01 44.45,69.01 ; 52.06,1.83 78.17,1.83 U22.5 ; 52.06,1.83 52.07,1.84 U11.2 52.07,14.4 U11.12 59.06,17.58 71.88,17.58 K230.1 ; 52.06,1.83 41.02,1.83 39.18,3.67 U14.5 ; U17.2 U18.2
  Bottom Layer w1.016: U14.5 39.18,5.71 37.47,3.99 24.77,3.99 20.32,8.43 20.32,33.58 H1.2 ; 5V.1 6.35,85.39 12.06,85.39 14.1,83.36 14.1,73.2 16,71.3 BT.5
+12V: length 91.3
  Top Layer w1.016: STEP2.8 STEP1.8 16.71,14.74 16.64,14.81 ; 16.64,14.81 16.64,9.19 15.62,8.18 15.62,3.1 ; 16.64,14.81 U12.4 13.97,23.67 11.3,21.01 5.59,21.01 3.07,18.49 U6.3
  Bottom Layer w1.016: 15.62,3.1 17.78,0.94 46.48,0.94 U11.1
GND:
  vias: v1(5.44,91.8) v1(5.44,81.64) v1(5.44,71.48) v1(5.44,66.4) v1(5.44,51.16) v1(5.44,46.08) v1(5.44,35.92) v1(5.44,30.84) v1(5.44,25.76) v1(5.44,15.6) v1(10.52,76.56) v1(10.52,71.48) v1(10.52,61.32) v1(10.52,56.24) v1(10.52,51.16) v1(10.52,46.08) v1(10.52,41) v1(10.52,35.92) v1(10.52,30.84) v1(10.52,25.76) v1(10.52,15.6) v1(10.52,10.52) v1(10.52,5.44) v1(15.6,66.4) v1(15.6,46.08) v1(15.6,41) v1(15.6,35.92) v1(15.6,30.84) v1(15.6,25.76) v1(15.95,93.74) v1(15.95,88.66) v1(20.68,96.88) v1(20.68,76.56) v1(20.68,66.4) v1(20.68,61.32) v1(20.68,56.24) v1(20.68,46.08) v1(20.68,41) v1(20.68,35.92) v1(20.68,5.44) v1(21.03,88.66) v1(25.76,76.56) v1(25.76,66.4) v1(25.76,61.32) v1(25.76,56.24) v1(25.76,46.08) v1(25.76,10.52) v1(25.76,5.44) v1(29.94,25.77) v1(29.94,20.69) v1(30.84,61.32) v1(30.84,56.24) v1(30.84,46.08) v1(30.84,41) v1(30.84,35.92) v1(30.84,5.44) v1(31.19,93.74) v1(35.92,76.56) v1(35.92,71.48) v1(35.92,66.4) v1(35.92,61.32) v1(35.92,56.24) v1(35.92,46.08) v1(35.92,41) v1(35.92,35.92) v1(35.92,30.84) v1(35.92,25.76) v1(35.92,20.68) v1(35.92,15.6) v1(35.92,5.44) v1(36.28,93.74) v1(36.28,88.66) v1(41,71.48) v1(41,66.4) v1(41,61.32) v1(41,56.24) v1(41,51.16) v1(41,35.92) v1(41,25.76) v1(41,5.44) v1(41.35,93.74) v1(46.08,71.48) v1(46.08,66.4) v1(46.08,61.32) v1(46.08,56.24) v1(46.08,51.16) v1(46.08,46.08) v1(46.08,20.68) v1(46.08,15.6) v1(46.08,5.44) v1(46.44,93.74) v1(51.16,71.48) v1(51.16,66.4) v1(51.16,61.32) v1(51.16,56.24) v1(51.16,51.16) v1(51.16,46.08) v1(51.16,25.76) v1(51.16,15.6) v1(51.51,93.74) v1(56.24,71.48) v1(56.24,66.4) v1(56.24,61.32) v1(56.24,56.24) v1(56.24,51.16) v1(56.24,46.08) v1(56.24,25.76) v1(56.24,15.6) v1(56.24,10.52) v1(56.59,93.74) v1(61.32,71.48) v1(61.32,66.4) v1(61.32,61.32) v1(61.32,56.24) v1(61.32,51.16) v1(61.32,46.08) v1(61.32,15.6) v1(61.32,10.52) v1(61.32,5.44) v1(61.68,93.74) v1(66.4,71.48) v1(66.4,66.4) v1(66.4,61.32) v1(66.4,56.24) v1(66.4,51.16) v1(66.4,46.08) v1(66.4,35.92) v1(66.4,25.76) v1(66.4,20.68) v1(66.4,15.6) v1(66.4,10.52) v1(66.4,5.44) v1(66.75,93.74) v1(71.48,71.48) v1(71.48,66.4) v1(71.48,61.32) v1(71.48,56.24) v1(71.48,51.16) v1(71.48,20.68) v1(71.48,15.6) v1(71.48,10.52) v1(71.48,5.44) v1(71.84,93.74) v1(76.56,71.48) v1(76.56,66.4) v1(76.56,61.32) v1(76.56,56.24) v1(76.56,51.16) v1(76.56,25.76) v1(76.56,15.6) v1(76.56,10.52) v1(76.56,5.44) v1(76.91,93.74) v1(81.64,71.48) v1(81.64,66.4) v1(81.64,61.32) v1(81.64,56.24) v1(81.64,51.16) v1(81.64,25.76) v1(81.64,15.6) v1(81.64,10.52) v1(86.72,71.48) v1(86.72,66.4) v1(86.72,61.32) v1(86.72,56.24) v1(86.72,51.16) v1(86.72,35.92) v1(86.72,20.68) v1(86.72,15.6) v1(86.72,10.52) v1(86.72,5.44) v1(87.07,93.74) v1(91.8,20.68) v1(91.8,15.6) v1(91.8,10.52) v1(91.8,5.44)
VCC: length 6.7
  Top Layer w1.016: U6.2 7.87,13.25 U4.4
A00: length 30.6
  Top Layer w0.254: STEP1.2 STEP2.2 33.25,29.74 36.19,32.69 42.6,32.69 U25.4
  Bottom Layer w0.254: U25.4 43.86,31.43 U2.3
A01: length 32.9
  Top Layer w0.254: U25.6 44.12,33.71 34.67,33.71 33.22,32.25 STEP2.1 STEP1.1
  Bottom Layer w0.254: U25.6 46.4,31.43 U2.5
A02: length 15.5
  Bottom Layer w0.254: U2.61 64.52,76.25 65.41,77.14 65.41,89.28 U3.20
A07: length 19.1
  Top Layer w0.254: U3.31 78.1,89.28 TRACK.2
  Bottom Layer w0.254: U3.31 79.43,78.88 U2.50
A08: length 9.3
  Bottom Layer w0.254: U2.7 48.95,40.68 U25.8
A09: length 9.3
  Bottom Layer w0.254: U2.9 51.48,31.43 U25.10
A10: length 15.4
  Bottom Layer w0.254: U25.11 55.25,30.1 55.25,42 U2.12
A11: length 15.4
  Bottom Layer w0.254: U25.13 56.57,29.57 57.78,30.78 57.78,42 U2.14
A12: length 9.3
  Bottom Layer w0.254: U2.29 76.89,40.68 U25.30
A13: length 15.4
  Bottom Layer w0.254: U25.29 78.1,30.1 78.1,42 U2.30
A14: length 15.3
  Bottom Layer w0.254: U2.69 53.97,76.25 55.25,77.52 55.25,89.28 U3.12
A15: length 9.2
  Bottom Layer w0.254: U2.70 54.03,78.88 U3.11
A16: length 15.3
  Bottom Layer w0.254: U2.67 57.78,77.56 57.78,89.28 U3.14
A17: length 9.2
  Bottom Layer w0.254: U2.68 56.57,78.88 U3.13
A18: length 9.2
  Bottom Layer w0.254: U3.35 84.51,78.88 U2.46
A21: length 9.2
  Bottom Layer w0.254: U3.17 61.65,78.88 U2.64
A22: length 9.2
  Bottom Layer w0.254: U3.9 51.49,78.88 U2.72
A23: length 9.2
  Bottom Layer w0.254: U3.19 64.19,78.88 U2.62
A24: length 32.9
  Top Layer w0.254: U20.1 27.18,76.5 30.86,80.19 44.92,80.19 U2.76
  Bottom Layer w0.254: U2.76 46.41,78.88 U3.5
A25: length 42.3
  Top Layer w0.254: U3.6 40.21,96.7 25.93,96.7 U16.2
  Bottom Layer w0.254: U3.6 47.62,89.28 47.62,77.27 46.61,76.25 U2.75
A26: length 30.9
  Top Layer w0.254: U16.3 33.13,86.67 42.57,86.67 U3.3
  Bottom Layer w0.254: U2.78 43.77,87.87 U3.3
A27: length 39.2
  Bottom Layer w0.254: buzzer.2 30.1,92.38 41.99,92.38 U3.4 45.09,89.28 45.09,77.14 44.2,76.25 U2.77
A28: length 48
  Top Layer w0.254: ICM45686.4 21.21,50.47 36.62,50.47 U2.4
  Bottom Layer w0.254: U2.4 45.09,42 45.09,30.1 U25.3
A29: length 39.8
  Bottom Layer w0.254: U22.4 85.34,11.5 85.34,24.56 81.97,27.94 U25.33 82.3,28.88 83.19,29.77 83.19,42 U2.34
A30: length 15.3
  Bottom Layer w0.254: U2.53 74.29,76.25 75.56,77.52 75.56,89.28 U3.28
A31: length 49.5
  Bottom Layer w0.254: U25.5 47.62,30.1 47.62,42 U2.6
  Bottom Layer w1.016: U2.6 40.3,49.33 19.81,49.33 ICM45686.5
AIN1: length 24.1
  Bottom Layer w0.254: U11.11 60.45,25.32 60.45,29.39 61.65,30.58 U25.18 61.65,40.68 U2.17
AIN2: length 24.1
  Bottom Layer w0.254: U11.10 57.91,25.32 57.91,29.51 59.11,30.71 U25.16 59.1,31.43 U2.15
AO1: length 16.9
  Bottom Layer w1.016: U14.6 53.59,7.54 U11.4
AO2: length 34.1
  Bottom Layer w1.016: U14.1 31.72,10.08 53.59,10.08 U11.5
B00: length 15.3
  Bottom Layer w0.254: U3.30 78.1,89.28 78.1,77.56 U2.51
B01: length 9.2
  Bottom Layer w0.254: U2.52 76.89,78.88 U3.29
B04: length 43
  Top Layer w0.254: U14.3 38.48,11.84 38.48,18.41 U25.7
  Bottom Layer w0.254: U2.8 50.11,42.05 50.11,29.59 49.4,28.88 U25.7
B05: length 43.1
  Top Layer w0.254: U14.4 40.26,11.12 40.26,17.65 U25.9
  Bottom Layer w0.254: U25.9 52.07,28.88 52.65,29.46 52.65,42.05 U2.10
B06: length 25.4
  Bottom Layer w0.254: K230.3 70.49,28.12 70.49,30.53 71.37,31.42 U25.26 71.8,31.43 U2.25
B07: length 28.9
  Bottom Layer w0.254: U2.26 73.03,42 73.03,30.15 71.81,28.93 U25.25 81.08,19.61 K230.4
B08: length 9.3
  Bottom Layer w0.254: U25.28 74.34,31.43 U2.27
B09: length 15.4
  Bottom Layer w0.254: U2.28 75.56,42 75.56,30.1 U25.27
B10: length 22.6
  Top Layer w0.254: U3.32 79.5,90.57 79.5,94.92 80.65,96.06 TRACK.3
  Bottom Layer w0.254: U2.49 80.65,77.56 80.65,89.28 U3.32
B11: length 22.6
  Top Layer w0.254: TRACK.4 83.19,96.19 82.04,95.05 82.04,90.57 U3.34
  Bottom Layer w0.254: U3.34 83.19,89.28 83.19,77.56 U2.47
B12: length 25
  Top Layer w0.254: U11.13 59.11,20.06 U25.15
  Bottom Layer w0.254: U2.16 60.32,42 60.32,30.66 59.11,29.44 U25.15
B13: length 25
  Top Layer w0.254: U25.17 61.65,20.06 U11.14
  Bottom Layer w0.254: U2.18 62.87,42 62.87,30.15 61.65,28.93 U25.17
B14: length 20.2
  Top Layer w0.254: TRACK.5 83.31,94.92 83.31,89.2 82.07,87.96 U3.33
  Bottom Layer w0.254: U2.48 81.97,78.88 U3.33
B15: length 24.2
  Top Layer w0.254: U11.9 49.78,19.48 55.25,24.94 55.25,30.2 U25.12
  Bottom Layer w0.254: U25.12 54.02,31.43 U2.11
B16: length 30.2
  Top Layer w0.254: U25.14 58.09,32.94 62.36,32.94 62.99,32.31 62.99,21.51 64.77,19.74 U11.15
  Bottom Layer w0.254: U2.13 56.57,40.68 U25.14
B17: length 60.5
  Bottom Layer w0.254: BT.2 17.14,79.17 27.94,79.17 33.02,74.09 56.86,74.09 U2.65 59.01,76.34 60.32,77.65 60.32,89.28 U3.16
B18: length 62.8
  Top Layer w0.254: U2.66 56.22,81.58 20.32,81.58 18.67,83.24 15.49,83.24 14.48,82.22 14.48,78.79 BT.3
  Bottom Layer w0.254: U2.66 59.11,78.88 U3.15
B19: length 15.3
  Bottom Layer w0.254: U2.63 61.59,76.25 62.87,77.52 62.87,89.28 U3.18
B20: length 15.3
  Bottom Layer w0.254: U2.71 51.39,76.34 52.71,77.65 52.71,89.28 U3.10
B21: length 15.4
  Bottom Layer w0.254: U2.55 71.88,76.25 73.03,77.39 73.03,89.28 U3.26
B22: length 9.2
  Bottom Layer w0.254: U2.56 71.81,78.88 U3.25
B23: length 9.3
  Bottom Layer w0.254: U2.31 79.43,40.68 U25.32
B24: length 9.2
  Bottom Layer w0.254: U2.74 48.95,78.88 U3.7
B25: length 15.3
  Bottom Layer w0.254: U3.8 50.16,89.28 50.16,77.56 U2.73
B26: length 41
  Bottom Layer w0.254: U22.3 79.76,7.67 84.07,11.99 84.07,24.23 U25.31 80.65,30.1 80.65,42 U2.32
B27: length 9.3
  Bottom Layer w0.254: U25.34 81.96,31.43 U2.33
BO1: length 25.3
  Bottom Layer w1.016: U11.7 66.55,2.21 82.04,2.21 86.51,6.68 U22.6
BO2: length 13.3
  Bottom Layer w1.016: U22.1 65.91,7.67 U11.6
OUT: length 20.6
  Top Layer w0.254: H1.3 21.84,32.56 21.84,24.31 23.91,22.24 STEP1.5
$1N61: length 5.3
  Top Layer w1.016: U18.1 30.99,66.73 U21.2
$1N76: length 6.1
  Top Layer w1.016: U17.1 31.35,74.09 U20.2

## Copper pours and planes (outline as drawn; the poured copper is in the pictures)
GND on Top Layer: -8.89,102.79 97.79,102.79 97.79,-3.5 -8.89,-3.5
GND on Bottom Layer: -2.41,101.14 94.11,101.14 94.11,-1.22 -2.41,-1.22

Small or netless copper shapes (teardrops, artwork), in the pictures only: 112 on Top Layer, 142 on Bottom Layer
